# Altium schematic sheet L9963E_BMS_IC.SchDoc
size A2; SheetNumber: 2; SheetTotal: 4
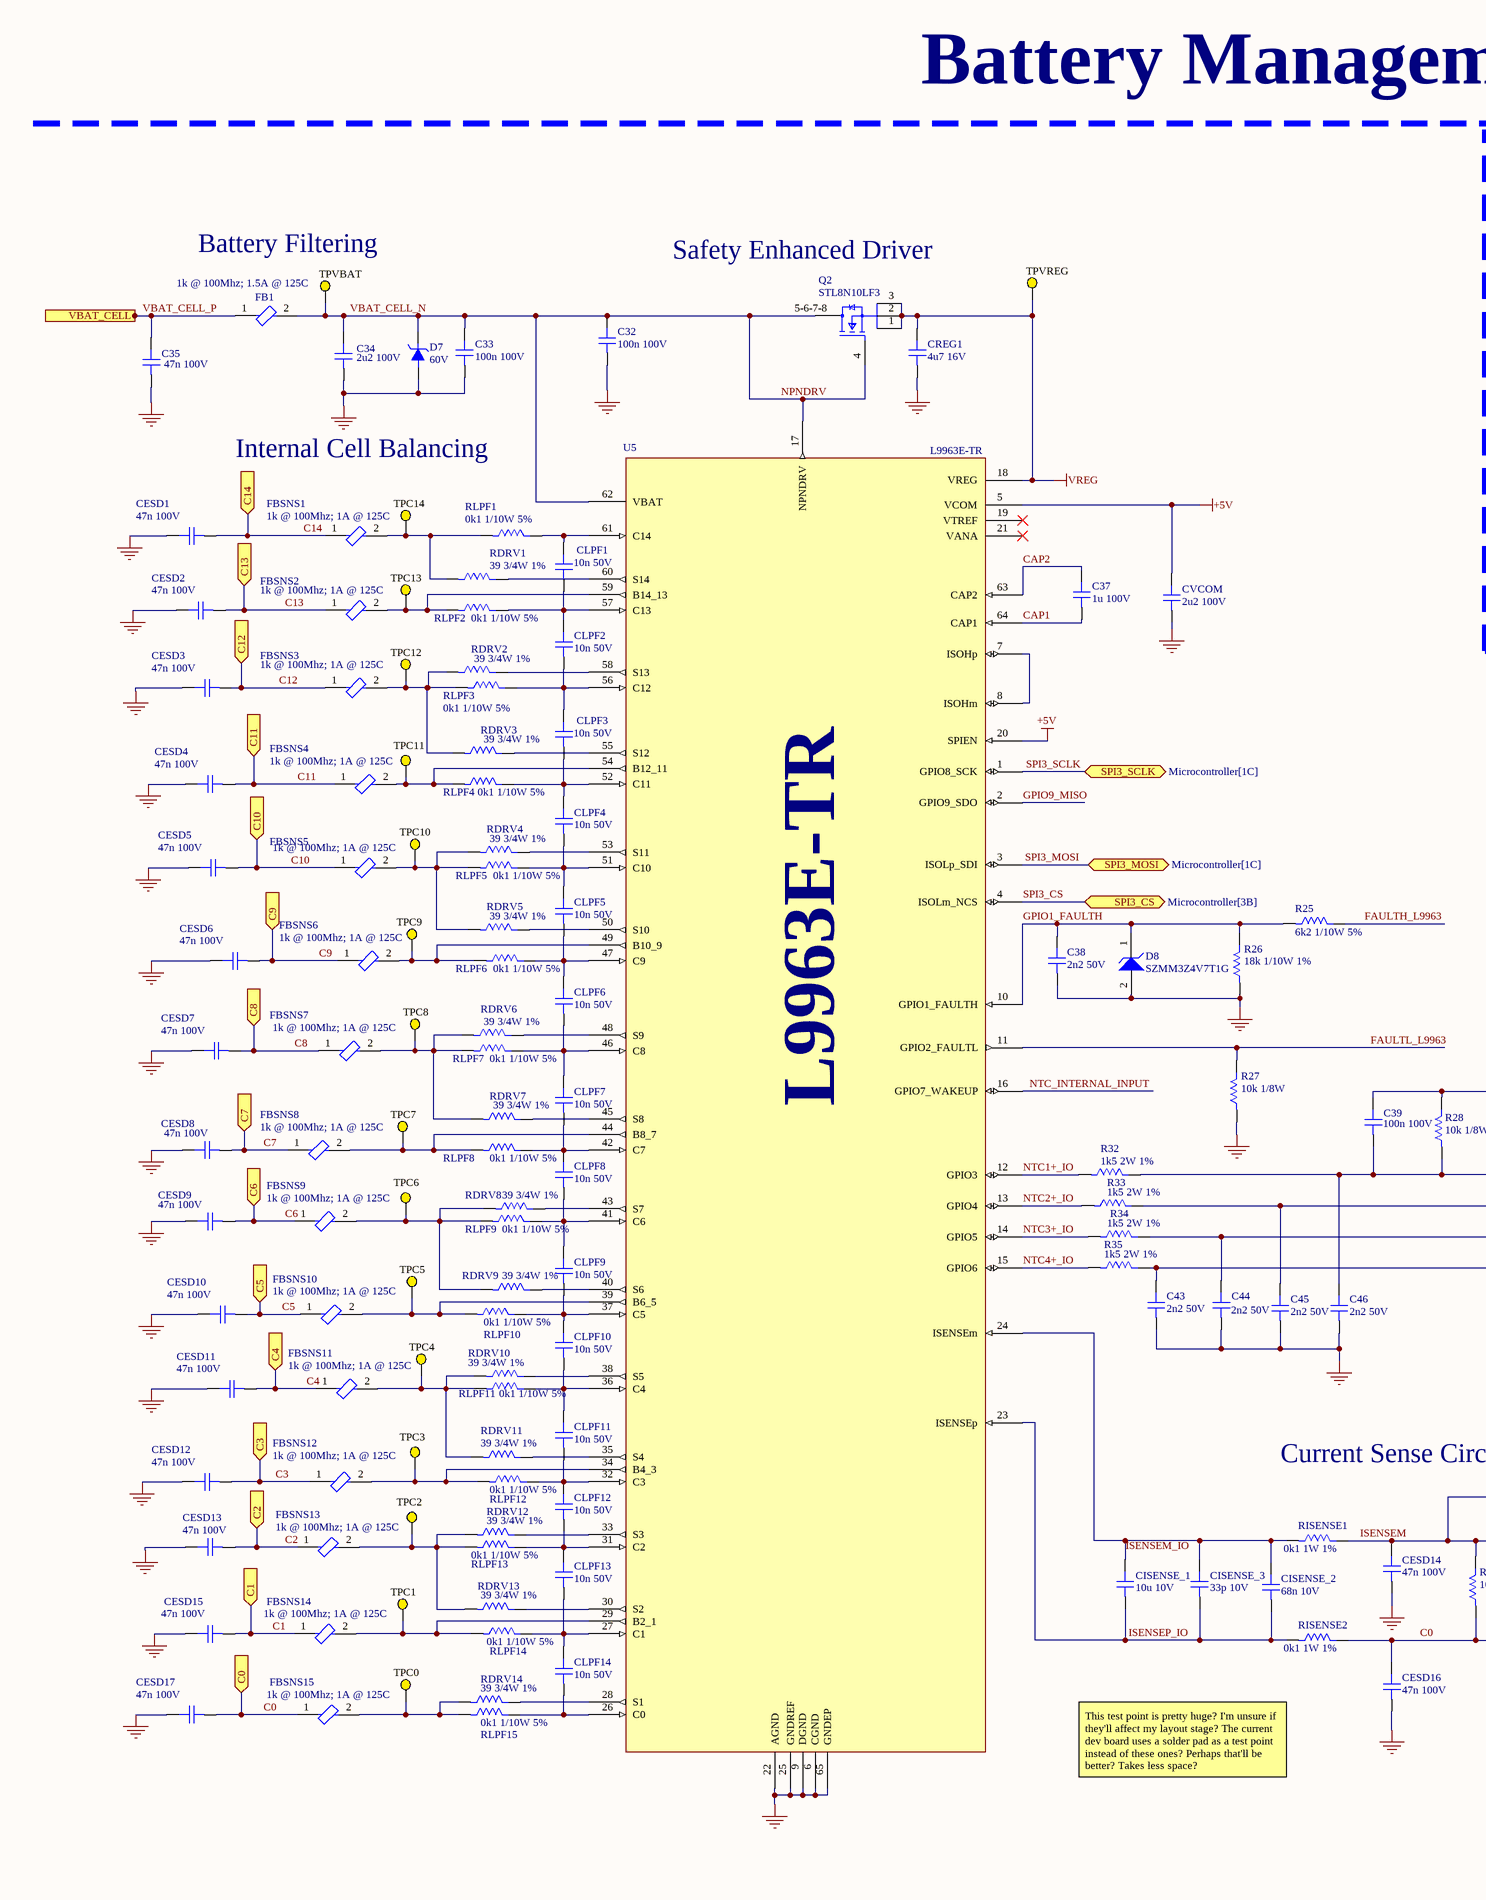
[diagram p0: L9963E_BMS_IC.SchDoc, left]
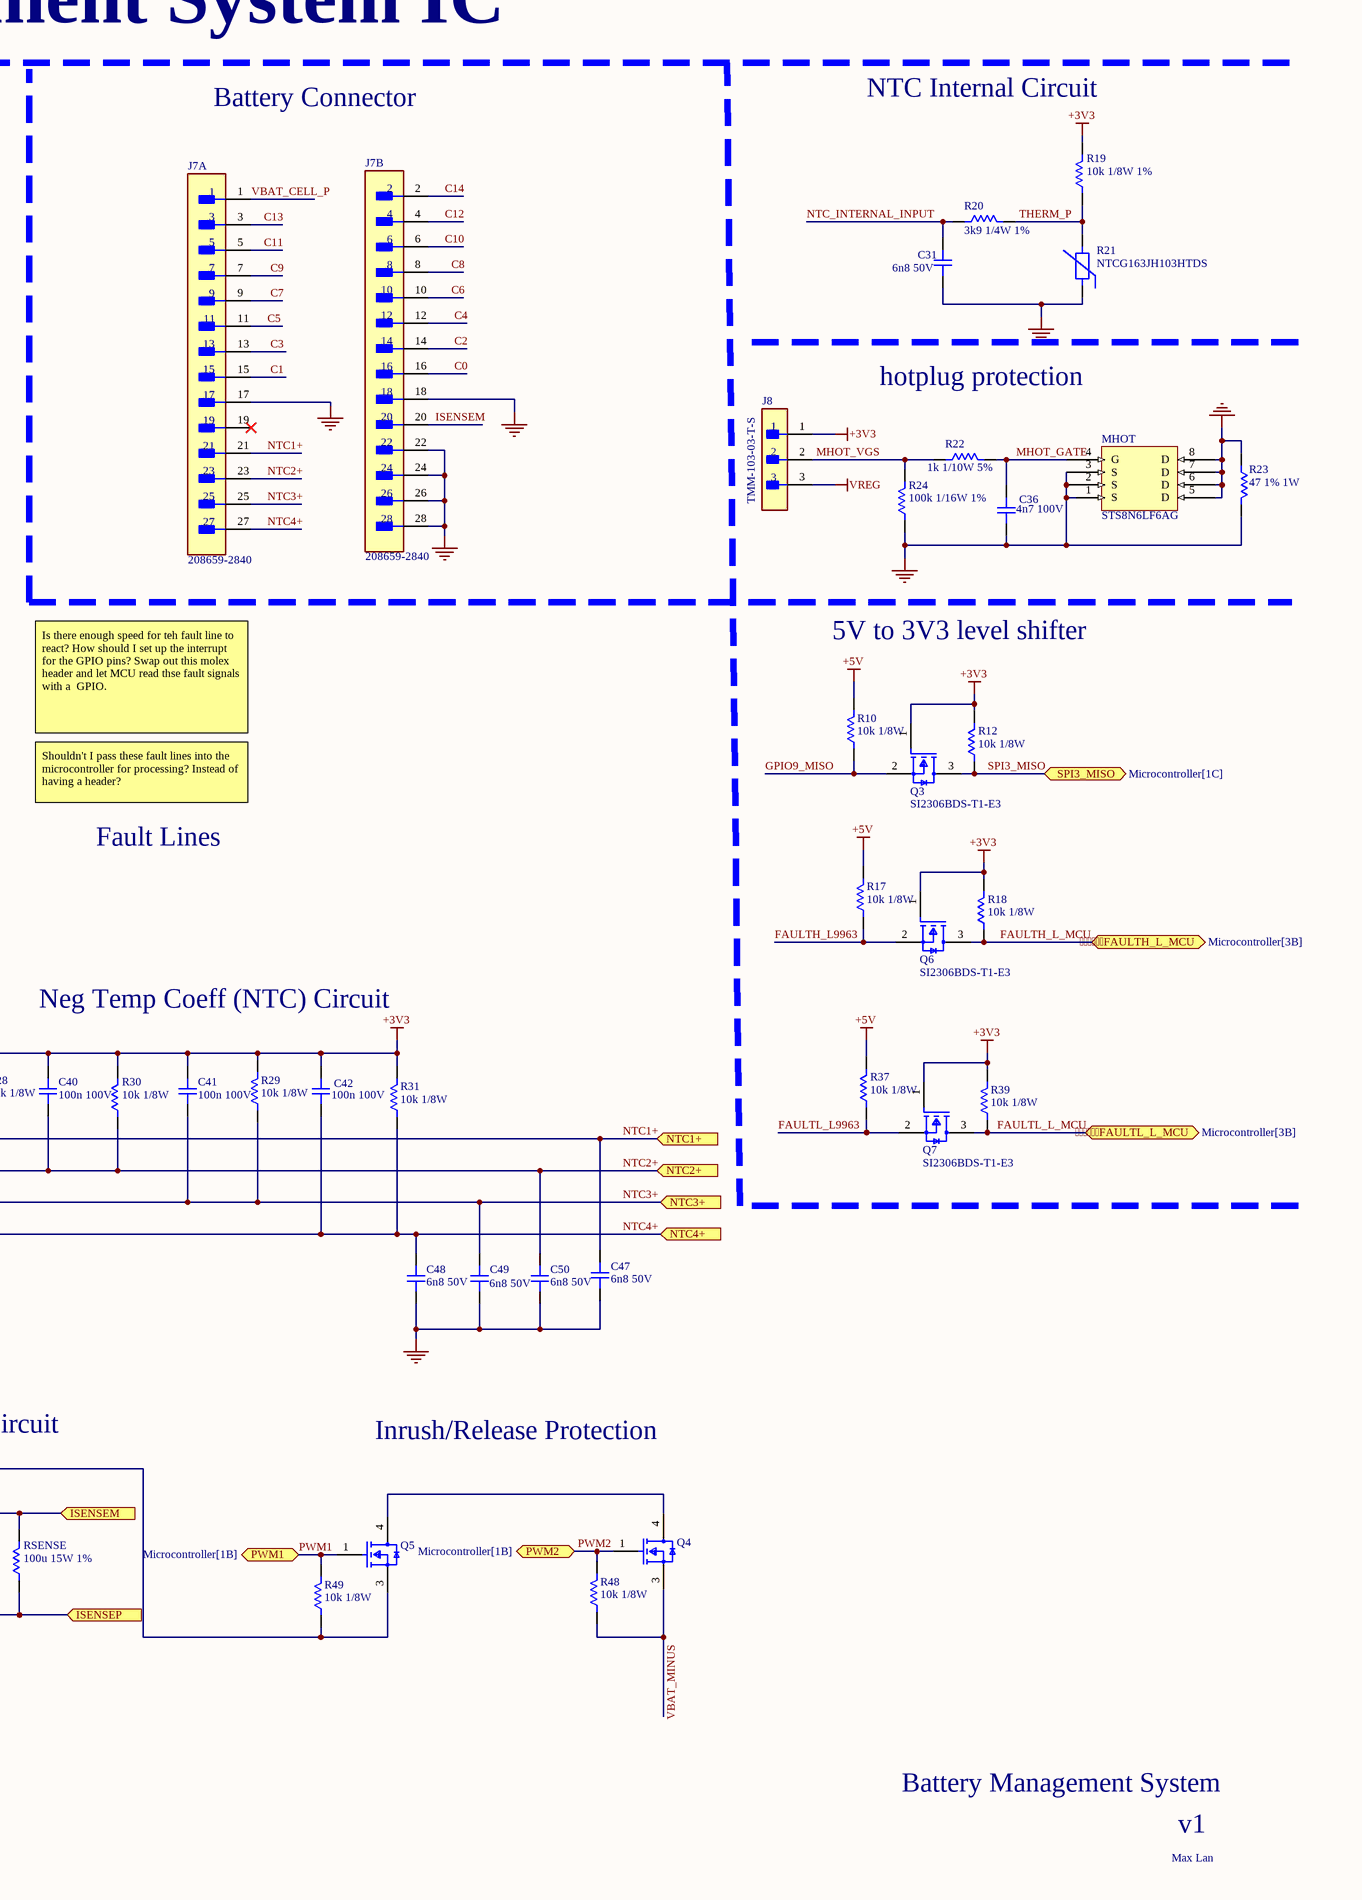
[diagram p1: L9963E_BMS_IC.SchDoc, right]

## Parts
C31  6n8 50V  [CAP_0603]
C32  100n 100V  [CAP_0603]
C33  100n 100V  [CAP_0603]
C34  2u2 100V  [CAP_1210]
C35  47n 100V  [CAP_0603]
C36  4n7 100V  [CAP_0603]
C37  1u 100V  [CAP_0603]
C38  2n2 50V  [CAP_0603]
C39  100n 100V  [CAP_0603]
C40  100n 100V  [CAP_0603]
C41  100n 100V  [CAP_0603]
C42  100n 100V  [CAP_0603]
C43  2n2 50V  [CAP_0603]
C44  2n2 50V  [CAP_0603]
C45  2n2 50V  [CAP_0603]
C46  2n2 50V  [CAP_0603]
C47  6n8 50V  [CAP_0603]
C48  6n8 50V  [CAP_0603]
C49  6n8 50V  [CAP_0603]
C50  6n8 50V  [CAP_0603]
CESD1  47n 100V  [CAP_0603]
CESD2  47n 100V  [CAP_0603]
CESD3  47n 100V  [CAP_0603]
CESD4  47n 100V  [CAP_0603]
CESD5  47n 100V  [CAP_0603]
CESD6  47n 100V  [CAP_0603]
CESD7  47n 100V  [CAP_0603]
CESD8  47n 100V  [CAP_0603]
CESD9  47n 100V  [CAP_0603]
CESD10  47n 100V  [CAP_0603]
CESD11  47n 100V  [CAP_0603]
CESD12  47n 100V  [CAP_0603]
CESD13  47n 100V  [CAP_0603]
CESD14  47n 100V  [CAP_0603]
CESD15  47n 100V  [CAP_0603]
CESD16  47n 100V  [CAP_0603]
CESD17  47n 100V  [CAP_0603]
CISENSE_1  10u 10V  [CAP_0603]
CISENSE_2  68n 10V  [CAP_0603]
CISENSE_3  33p 10V  [CAP_0402]
CLPF1  10n 50V  [CAP_0603]
CLPF2  10n 50V  [CAP_0603]
CLPF3  10n 50V  [CAP_0603]
CLPF4  10n 50V  [CAP_0603]
CLPF5  10n 50V  [CAP_0603]
CLPF6  10n 50V  [CAP_0603]
CLPF7  10n 50V  [CAP_0603]
CLPF8  10n 50V  [CAP_0603]
CLPF9  10n 50V  [CAP_0603]
CLPF10  10n 50V  [CAP_0603]
CLPF11  10n 50V  [CAP_0603]
CLPF12  10n 50V  [CAP_0603]
CLPF13  10n 50V  [CAP_0603]
CLPF14  10n 50V  [CAP_0603]
CREG1  4u7 16V  [CAP_0805]
CVCOM  2u2 100V  [CAP_1210]
D7  60V  [5.0SMDJ60A]
D8  SZMM3Z4V7T1G  [ONSC-SOD-323-2-477-02_V]
FB1  1k @ 100Mhz; 1.5A @ 125C  [FP-MPZ2012-MFG]
FBSNS1  1k @ 100Mhz; 1A @ 125C  [FP-MPZ2012-MFG]
FBSNS2  1k @ 100Mhz; 1A @ 125C  [FP-MPZ2012-MFG]
FBSNS3  1k @ 100Mhz; 1A @ 125C  [FP-MPZ2012-MFG]
FBSNS4  1k @ 100Mhz; 1A @ 125C  [FP-MPZ2012-MFG]
FBSNS5  1k @ 100Mhz; 1A @ 125C  [FP-MPZ2012-MFG]
FBSNS6  1k @ 100Mhz; 1A @ 125C  [FP-MPZ2012-MFG]
FBSNS7  1k @ 100Mhz; 1A @ 125C  [FP-MPZ2012-MFG]
FBSNS8  1k @ 100Mhz; 1A @ 125C  [FP-MPZ2012-MFG]
FBSNS9  1k @ 100Mhz; 1A @ 125C  [FP-MPZ2012-MFG]
FBSNS10  1k @ 100Mhz; 1A @ 125C  [FP-MPZ2012-MFG]
FBSNS11  1k @ 100Mhz; 1A @ 125C  [FP-MPZ2012-MFG]
FBSNS12  1k @ 100Mhz; 1A @ 125C  [FP-MPZ2012-MFG]
FBSNS13  1k @ 100Mhz; 1A @ 125C  [FP-MPZ2012-MFG]
FBSNS14  1k @ 100Mhz; 1A @ 125C  [FP-MPZ2012-MFG]
FBSNS15  1k @ 100Mhz; 1A @ 125C  [FP-MPZ2012-MFG]
J7  208659-2840  [FP-208659-2840-MFG]  (parts A,B of 2)
J8  TMM-103-03-T-S  [FP-TMM-103-03-T-S-MFG]
MHOT  STS8N6LF6AG  [STS8N6LF6AG]
Q2  STL8N10LF3  [FP-PowerFLAT5x6-A0Y5_8231-MFG]
Q3  SI2306BDS-T1-E3  [FP-S-03946-IPC_A]
Q4  HUF76629D3ST  [FP-369AS-MFG]  (value not drawn)
Q5  HUF76629D3ST  [FP-369AS-MFG]  (value not drawn)
Q6  SI2306BDS-T1-E3  [FP-S-03946-IPC_A]
Q7  SI2306BDS-T1-E3  [FP-S-03946-IPC_A]
R10  10k 1/8W  [RES_0603]
R12  10k 1/8W  [RES_0603]
R17  10k 1/8W  [RES_0603]
R18  10k 1/8W  [RES_0603]
R19  10k 1/8W 1%  [RES_0603]
R20  3k9 1/4W 1%  [RES_0805]
R21  NTCG163JH103HTDS  [RES_0603]
R22  1k 1/10W 5%  [RES_0603]
R23  47 1% 1W  [RES_2512]
R24  100k 1/16W 1%  [RES_0402]
R25  6k2 1/10W 5%  [RES_0603]
R26  18k 1/10W 1%  [RES_0603]
R27  10k 1/8W  [RES_0603]
R28  10k 1/8W  [RES_0603]
R29  10k 1/8W  [RES_0603]
R30  10k 1/8W  [RES_0603]
R31  10k 1/8W  [RES_0603]
R32  1k5 2W 1%  [RES_2010]
R33  1k5 2W 1%  [RES_2010]
R34  1k5 2W 1%  [RES_2010]
R35  1k5 2W 1%  [RES_2010]
R37  10k 1/8W  [RES_0603]
R39  10k 1/8W  [RES_0603]
R48  10k 1/8W  [RES_0603]
R49  10k 1/8W  [RES_0603]
RDRV1  39 3/4W 1%  [RES_0603]
RDRV2  39 3/4W 1%  [RES_0603]
RDRV3  39 3/4W 1%  [RES_0603]
RDRV4  39 3/4W 1%  [RES_0603]
RDRV5  39 3/4W 1%  [RES_0603]
RDRV6  39 3/4W 1%  [RES_0603]
RDRV7  39 3/4W 1%  [RES_0603]
RDRV8  39 3/4W 1%  [RES_0603]
RDRV9  39 3/4W 1%  [RES_0603]
RDRV10  39 3/4W 1%  [RES_0603]
RDRV11  39 3/4W 1%  [RES_0603]
RDRV12  39 3/4W 1%  [RES_0603]
RDRV13  39 3/4W 1%  [RES_0603]
RDRV14  39 3/4W 1%  [RES_0603]
RISENSE1  0k1 1W 1%  [RES_2010]
RISENSE2  0k1 1W 1%  [RES_2010]
RLPF1  0k1 1/10W 5%  [RES_0603]
RLPF2  0k1 1/10W 5%  [RES_0603]
RLPF3  0k1 1/10W 5%  [RES_0603]
RLPF4  0k1 1/10W 5%  [RES_0603]
RLPF5  0k1 1/10W 5%  [RES_0603]
RLPF6  0k1 1/10W 5%  [RES_0603]
RLPF7  0k1 1/10W 5%  [RES_0603]
RLPF8  0k1 1/10W 5%  [RES_0603]
RLPF9  0k1 1/10W 5%  [RES_0603]
RLPF10  0k1 1/10W 5%  [RES_0603]
RLPF11  0k1 1/10W 5%  [RES_0603]
RLPF12  0k1 1/10W 5%  [RES_0603]
RLPF13  0k1 1/10W 5%  [RES_0603]
RLPF14  0k1 1/10W 5%  [RES_0603]
RLPF15  0k1 1/10W 5%  [RES_0603]
RSENSE  100u 15W 1%  [RES_5931]
TPC0  5014  [KSTN-5014_V]  (value not drawn)
TPC1  5014  [KSTN-5014_V]  (value not drawn)
TPC2  5014  [KSTN-5014_V]  (value not drawn)
TPC3  5014  [KSTN-5014_V]  (value not drawn)
TPC4  5014  [KSTN-5014_V]  (value not drawn)
TPC5  5014  [KSTN-5014_V]  (value not drawn)
TPC6  5014  [KSTN-5014_V]  (value not drawn)
TPC7  5014  [KSTN-5014_V]  (value not drawn)
TPC8  5014  [KSTN-5014_V]  (value not drawn)
TPC9  5014  [KSTN-5014_V]  (value not drawn)
TPC10  5014  [KSTN-5014_V]  (value not drawn)
TPC11  5014  [KSTN-5014_V]  (value not drawn)
TPC12  5014  [KSTN-5014_V]  (value not drawn)
TPC13  5014  [KSTN-5014_V]  (value not drawn)
TPC14  5014  [KSTN-5014_V]  (value not drawn)
TPVBAT  5014  [KSTN-5014_V]  (value not drawn)
TPVREG  5014  [KSTN-5014_V]  (value not drawn)
U5  L9963E-TR  [L9963E-TR]

## Ports
FAULTH_L_MCU (bidir, see Microcontroller[3B]), FAULTL_L_MCU (bidir, see Microcontroller[3B]), C0 (in), C1 (in), C2 (in), C3 (in), C4 (in), C5 (in), C6 (in), C7 (in), C8 (in), C9 (in), C10 (in), C11 (in), C12 (in), C13 (in), C14 (in), ISENSEM (in), ISENSEP (in), NTC1+ (in), NTC2+ (in), NTC3+ (in), NTC4+ (in), PWM1 (bidir, see Microcontroller[1B]), PWM2 (bidir, see Microcontroller[1B]), SPI3_CS (bidir, see Microcontroller[3B]), SPI3_MISO (bidir, see Microcontroller[1C]), SPI3_MOSI (bidir, see Microcontroller[1C]), SPI3_SCLK (bidir, see Microcontroller[1C]), VBAT_CELL (in)

## Nets
+3V3: C39.2 C40.2 C41.2 C42.2 J8.1 Q3.1(G) Q6.1(G) Q7.1(G) R12.2 R18.2 R19.2 R28.2 R29.2 R30.2 R31.2 R39.2
+5V: CVCOM.2 R10.2 R17.2 R37.2 U5.5(VCOM) U5.20(SPIEN)
GND: C31.1 C32.1 C33.1 C34.1 C35.1 C36.1 C38.1 C43.1 C44.1 C45.1 C46.1 C47.1 C48.1 C49.1 C50.1 CESD1.2 CESD2.2 CESD3.2 CESD4.2 CESD5.2 CESD6.2 CESD7.2 CESD8.2 CESD9.2 CESD10.2 CESD11.2 CESD12.2 CESD13.2 CESD14.1 CESD15.2 CESD16.1 CESD17.2 CREG1.1 CVCOM.1 D7.A D8.2(A) J7.17 J7.18 J7.22 J7.24 J7.26 J7.28 MHOT.1(S) MHOT.2(S) MHOT.3(S) MHOT.5(D) MHOT.6(D) MHOT.7(D) MHOT.8(D) R21.2 R23.1 R23.2 R24.1 R26.1 R27.1 U5.6(CGND) U5.9(DGND) U5.22(AGND) U5.25(GNDREF) U5.65(GNDEP)
VREG: CREG1.2 J8.3 Q2.1(S) Q2.2(S) Q2.3(S) TPVREG.1 U5.18(VREG)
C0: CESD16.2 CESD17.1 FBSNS15.1 J7.16 RISENSE2.2 RSENSE.1 ; port C0, port ISENSEP
C1: CESD15.1 FBSNS14.1 J7.15 ; port C1
C2: CESD13.1 FBSNS13.1 J7.14 ; port C2
C3: CESD12.1 FBSNS12.1 J7.13 ; port C3
C4: CESD11.1 FBSNS11.1 J7.12 ; port C4
C5: CESD10.1 FBSNS10.1 J7.11 ; port C5
C6: CESD9.1 FBSNS9.1 J7.10 ; port C6
C7: CESD8.1 FBSNS8.1 J7.9 ; port C7
C8: CESD7.1 FBSNS7.1 J7.8 ; port C8
C9: CESD6.1 FBSNS6.1 J7.7 ; port C9
C10: CESD5.1 FBSNS5.1 J7.6 ; port C10
C11: CESD4.1 FBSNS4.1 J7.5 ; port C11
C12: CESD3.1 FBSNS3.1 J7.4 ; port C12
C13: CESD2.1 FBSNS2.1 J7.3 ; port C13
C14: CESD1.1 FBSNS1.1 J7.2 ; port C14
CAP1: C37.1 U5.64(CAP1)
CAP2: C37.2 U5.63(CAP2)
FAULTH_L9963: Q6.2(S) R17.1 R25.2
FAULTH_L_MCU: Q6.3(D) R18.1 ; port FAULTH_L_MCU
FAULTL_L9963: Q7.2(S) R27.2 R37.1 U5.11(GPIO2_FAULTL)
FAULTL_L_MCU: Q7.3(D) R39.1 ; port FAULTL_L_MCU
GPIO1_FAULTH: C38.2 D8.1(K) R25.1 R26.2 U5.10(GPIO1_FAULTH)
GPIO9_MISO: Q3.2(S) R10.1 U5.2(GPIO9_SDO)
ISENSEM: CESD14.2 J7.20 Q5.3(S) R49.1 RISENSE1.2 RSENSE.2 ; port ISENSEM
ISENSEM_IO: CISENSE_1.2 CISENSE_2.2 CISENSE_3.2 RISENSE1.1 U5.24(ISENSEm)
ISENSEP_IO: CISENSE_1.1 CISENSE_2.1 CISENSE_3.1 RISENSE2.1 U5.23(ISENSEp)
MHOT_GATE: C36.2 MHOT.4(G) R22.2
MHOT_VGS: J8.2 R22.1 R24.2
NPNDRV: C32.2 C33.2 C34.2 D7.K FB1.2 Q2.4(G) Q2.5-6-7-8(D) TPVBAT.1 U5.17(NPNDRV) U5.62(VBAT)  [also labelled VBAT_CELL_N]
NTC1+: C39.1 C46.2 C47.2 J7.21 R28.1 R32.2 ; port NTC1+
NTC1+_IO: R32.1 U5.12(GPIO3)
NTC2+: C40.1 C45.2 C50.2 J7.23 R30.1 R33.2 ; port NTC2+
NTC2+_IO: R33.1 U5.13(GPIO4)
NTC3+: C41.1 C44.2 C49.2 J7.25 R29.1 R34.2 ; port NTC3+
NTC3+_IO: R34.1 U5.14(GPIO5)
NTC4+: C42.1 C43.2 C48.2 J7.27 R31.1 R35.2 ; port NTC4+
NTC4+_IO: R35.1 U5.15(GPIO6)
NTC_INTERNAL_INPUT: C31.2 R20.1 U5.16(GPIO7_WAKEUP)
PWM1: Q5.1(G) R49.2 ; port PWM1
PWM2: Q4.1(G) R48.2 ; port PWM2
SPI3_CS: U5.4(ISOLm_NCS) ; port SPI3_CS
SPI3_MISO: Q3.3(D) R12.1 ; port SPI3_MISO
SPI3_MOSI: U5.3(ISOLp_SDI) ; port SPI3_MOSI
SPI3_SCLK: U5.1(GPIO8_SCK) ; port SPI3_SCLK
THERM_P: R19.1 R20.2 R21.1
VBAT_CELL_P: C35.2 FB1.1 J7.1 ; port VBAT_CELL
VBAT_MINUS: Q4.3(S) R48.1
NetCLPF1_1: CLPF1.1 CLPF2.2 RLPF2.2 U5.57(C13)
NetCLPF1_2: CLPF1.2 RLPF1.2 U5.61(C14)
NetCLPF2_1: CLPF2.1 CLPF3.2 RLPF3.2 U5.56(C12)
NetCLPF3_1: CLPF3.1 CLPF4.2 RLPF4.2 U5.52(C11)
NetCLPF4_1: CLPF4.1 CLPF5.2 RLPF5.2 U5.51(C10)
NetCLPF5_1: CLPF5.1 CLPF6.2 RLPF6.2 U5.47(C9)
NetCLPF6_1: CLPF6.1 CLPF7.2 RLPF7.2 U5.46(C8)
NetCLPF7_1: CLPF7.1 CLPF8.2 RLPF8.2 U5.42(C7)
NetCLPF8_1: CLPF8.1 CLPF9.2 RLPF9.2 U5.41(C6)
NetCLPF9_1: CLPF9.1 CLPF10.2 RLPF10.2 U5.37(C5)
NetCLPF10_1: CLPF10.1 CLPF11.2 RLPF11.2 U5.36(C4)
NetCLPF11_1: CLPF11.1 CLPF12.2 RLPF12.2 U5.32(C3)
NetCLPF12_1: CLPF12.1 CLPF13.2 RLPF13.2 U5.31(C2)
NetCLPF13_1: CLPF13.1 CLPF14.2 RLPF14.2 U5.27(C1)
NetCLPF14_1: CLPF14.1 RLPF15.2 U5.26(C0)
NetFBSNS1_2: FBSNS1.2 RDRV1.1 RLPF1.1 TPC14.1
NetFBSNS2_2: FBSNS2.2 RLPF2.1 TPC13.1 U5.59(B14_13)
NetFBSNS3_2: FBSNS3.2 RDRV2.1 RDRV3.1 RLPF3.1 TPC12.1
NetFBSNS4_2: FBSNS4.2 RLPF4.1 TPC11.1 U5.54(B12_11)
NetFBSNS5_2: FBSNS5.2 RDRV4.1 RDRV5.1 RLPF5.1 TPC10.1
NetFBSNS6_2: FBSNS6.2 RLPF6.1 TPC9.1 U5.49(B10_9)
NetFBSNS7_2: FBSNS7.2 RDRV6.1 RDRV7.1 RLPF7.1 TPC8.1
NetFBSNS8_2: FBSNS8.2 RLPF8.1 TPC7.1 U5.44(B8_7)
NetFBSNS9_2: FBSNS9.2 RDRV8.1 RDRV9.1 RLPF9.1 TPC6.1
NetFBSNS10_2: FBSNS10.2 RLPF10.1 TPC5.1 U5.39(B6_5)
NetFBSNS11_2: FBSNS11.2 RDRV10.1 RDRV11.1 RLPF11.1 TPC4.1
NetFBSNS12_2: FBSNS12.2 RLPF12.1 TPC3.1 U5.34(B4_3)
NetFBSNS13_2: FBSNS13.2 RDRV12.1 RDRV13.1 RLPF13.1 TPC2.1
NetFBSNS14_2: FBSNS14.2 RLPF14.1 TPC1.1 U5.29(B2_1)
NetFBSNS15_2: FBSNS15.2 RDRV14.1 RLPF15.1 TPC0.1
NetQ4_4: Q4.4(D) Q5.4(D)
NetRDRV1_2: RDRV1.2 U5.60(S14)
NetRDRV2_2: RDRV2.2 U5.58(S13)
NetRDRV3_2: RDRV3.2 U5.55(S12)
NetRDRV4_2: RDRV4.2 U5.53(S11)
NetRDRV5_2: RDRV5.2 U5.50(S10)
NetRDRV6_2: RDRV6.2 U5.48(S9)
NetRDRV7_2: RDRV7.2 U5.45(S8)
NetRDRV8_2: RDRV8.2 U5.43(S7)
NetRDRV9_2: RDRV9.2 U5.40(S6)
NetRDRV10_2: RDRV10.2 U5.38(S5)
NetRDRV11_2: RDRV11.2 U5.35(S4)
NetRDRV12_2: RDRV12.2 U5.33(S3)
NetRDRV13_2: RDRV13.2 U5.30(S2)
NetRDRV14_2: RDRV14.2 U5.28(S1)
NetU5_7: U5.7(ISOHp) U5.8(ISOHm)

Not connected (* = marked no-connect by the designer): J7 19*; U5 19(VTREF)* 21(VANA)*

## Notes on the sheet
- Battery Management System IC
- Battery Connector
- NTC Internal Circuit
- (near TPVBAT) Battery Filtering
- (near Q2) Safety Enhanced Driver
- Internal Cell Balancing
- hotplug protection
- 5V to 3V3 level shifter
- Is there enough speed for teh fault line to react? How should I set up the interrupt for the GPIO pins? Swap out this molex header and let MCU read thse fault signals with a  GPIO.
- Shouldn't I pass these fault lines into the microcontroller for processing? Instead of having a header?
- Fault Lines
- Neg Temp Coeff (NTC) Circuit
- Current Sense Circuit
- Inrush/Release Protection
- This test point is pretty huge? I'm unsure if they'll affect my layout stage? The current dev board uses a solder pad as a test point instead of these ones? Perhaps that'll be better? Takes less space?
- Battery Management System
- Max Lan
- v1

## Library data of the parts
C31 C47-C50 = 06035C682MAT2A: Multilayer Ceramic Capacitors MLCC - SMD/SMT KGM15AR71H682MT NEW GLOBAL PN 50V 6800pF A 581-KGM15AR71H682MT; Manufacturer: KYOCERA AVX; Rating: 6.8nF 50V X7R 0603; Manufacturer Part Number: 06035C682MAT2A; Distributor Link: https://www.mouser.tw/en/ProductDetail/KYOCERA-AVX/06035C682MAT2A?qs=Jt0XQ7CXnDG9m2YKP51QXw%3D%3D; Datasheet Link: https://datasheets.kyocera-avx.com/KGM_X7R.pdf; Dielectric: *
C32 C33 C39-C42 = MAJCH168BB7104KTEA01: Multilayer Ceramic Capacitors MLCC - SMD/SMT 100V 0.1uF 0603 X7R 10% AECQ2; Manufacturer: TAIYO YUDEN; Rating: 100nF 100V X7R 0603 10%; Manufacturer Part Number: MAJCH168BB7104KTEA01; Distributor Link: https://www.mouser.tw/en/ProductDetail/TAIYO-YUDEN/MAJCH168BB7104KTEA01?qs=ZcfC38r4PovaTBrG0IdezQ%3D%3D; Datasheet Link: https://www.mouser.com/catalog/specsheets/TAIYO_YUDEN_03-08-2024_MAJCH168BB7104KTEA01_SS.pdf?_gl=1*17qbpp1*_gcl_aw*R0NMLjE3ODUyMjg2NDkuQ2p3S0NBandwcUhUQmhBY0Vpd0FqMkFmdXJYOV9OUy1CV0xFSmd6T0FaYy1HZXR1bHVfaUZmaHVzRkI2bHhkODVUMjVSNlJWbnBOUkFob0NEdHNRQXZEX0J3RQ..*_gcl_au*MTM0NzYwMzc0Mi4xNzgyNDQ3MDMwLjE4MDQ0Nzg2ODUuMTc4NTI5MDg4OS4xNzg1MjkxOTE2LjE1NDk0Mzk5MTcuMTc4NTIxODYwOC4xNzg1MjkxOTE2*_ga*MTg5NTU5OTIyLjE3ODI0NDcwMzM.*_ga_15W4STQT4T*czE3ODUyODM3NTgkbzk5JGcxJHQxNzg1MjkxOTI1JGo0MiRsMCRoMA..; Dielectric: *
C34 CVCOM = C1210C225J1RACAUTO: Multilayer Ceramic Capacitors MLCC - SMD/SMT 100V 2.2uF X7R 1210 5% AEC-Q200; Manufacturer: KEMET; Rating: 2.2uF 100V X7R 1210 5%; Manufacturer Part Number: C1210C225J1RACAUTO; Distributor Link: https://www.mouser.tw/en/ProductDetail/KEMET/C1210C225J1RACAUTO?qs=sGAEpiMZZMvsSlwiRhF8qtbmv%2FbKa1yYzrRuCBjX9aFrg%252BEkfh5A0g%3D%3D; Datasheet Link: https://www.mouser.tw/datasheet/3/508/1/KEM_C1023_X7R_AUTO_SMD.pdf; Dielectric: *
C35 CESD1-CESD17 = C0603C473J1RACTU: Multilayer Ceramic Capacitors MLCC - SMD/SMT 100V 0.047uF X7R 0603 5%; Manufacturer: KEMET; Rating: 47nF 100V X7R 0603 5%; Manufacturer Part Number: C0603C473J1RACTU; Distributor Link: https://www.mouser.tw/en/ProductDetail/KEMET/C0603C473J1RACTU?qs=sGAEpiMZZMvsSlwiRhF8qpRMYGxmftL79YZ310PzB5U%3D; Datasheet Link: https://www.mouser.tw/datasheet/3/72/1/C0603C473J1RACTU.pdf; Dielectric: *
C36 = CGA3E2X7R2A472K080AA: Multilayer Ceramic Capacitors MLCC - SMD/SMT CGA 0603 100V 4700pF X7R 10% AEC-Q200; Manufacturer: TDK; Rating: 4.7nF 100V 10% X7R 0603; Manufacturer Part Number: CGA3E2X7R2A472K080AA; Distributor Link: https://www.mouser.tw/en/ProductDetail/TDK/CGA3E2X7R2A472K080AA?qs=NRhsANhppD8QTPocwjf0SQ%3D%3D; Datasheet Link: https://product.tdk.com/system/files/dam/doc/product/capacitor/ceramic/mlcc/catalog/mlcc_automotive_midvoltage_en.pdf?ref_disty=mouser; Dielectric: *
C37 = C1608X7R2A105K080AC: MLCC - SMD/SMT Commercial Grade,MLCC,0603,X7R,100V,1uF,+/-10%,0.8mm; Manufacturer Name: TDK; ComponentLink1Description: Datasheet Link 1; ComponentLink1URL: https://product.tdk.com/system/files/dam/doc/product/capacitor/ceramic/mlcc/catalog/mlcc_commercial_general_en.pdf; Distributor Name: Mouser; ComponentLink2Description: Distributor Link 1; ComponentLink2URL: https://www.mouser.tw/zh/ProductDetail/TDK/C1608X7R2A105K080AC?qs=efUn273yAhc5BfjaNflQJg%3D%3D; Value: 0603,X7R,100V,1uF,
C38 C43-C46 = KAM15AR71H222KT: Multilayer Ceramic Capacitors MLCC - SMD/SMT 50V 2200pF X7R 0603 10% AEC-Q200; Manufacturer: KYOCERA AVX; Rating: 2.2nF 50V X7R 0603 10%; Manufacturer Part Number: KAM15AR71H222KT; Distributor Link: https://www.mouser.tw/en/ProductDetail/KYOCERA-AVX/KAM15AR71H222KT?qs=OcgtsXO%252B3gvpJlkWsZMdBg%3D%3D; Datasheet LInk: https://ele.kyocera.com/assets/products/capacitor/KGM_Series_e.pdf; Dielectric: *
CISENSE_1 = GRM188Z71A106KA73D: Multilayer Ceramic Capacitors MLCC - SMD/SMT 10 uF 10 VDC 10% 0603 X7R; Manufacturer: Murata Electronics; Rating: 10uF 10V X7R 0603 10%; Manufacturer Part Number: GRM188Z71A106KA73D; Distributor Link: https://www.mouser.tw/en/ProductDetail/Murata-Electronics/GRM188Z71A106KA73D?qs=sGAEpiMZZMvsSlwiRhF8qtsGU%2FCnaNeQz1Jv5GwJ1ahYh1H97x5nNw%3D%3D; Datasheet Link: https://www.mouser.tw/datasheet/3/76/2/GRM188Z71A106KA73_01A.pdf; Dielectric: *
CISENSE_2 = VJ0603Y683JXQCW1BC: Multilayer Ceramic Capacitors MLCC - SMD/SMT 0603 0.068uF 10volts X7R 5%; Manufacturer: Vishay/Vitramon; Rating: 68nF 10V X7R 0603 5%; Manufacturer Part Number: VJ0603Y683JXQCW1BC; Distributor Link: https://www.mouser.tw/en/ProductDetail/Vishay-Vitramon/VJ0603Y683JXQCW1BC?qs=sGAEpiMZZMvsSlwiRhF8qsy6D4RIz3svadoEWL3SLRA%3D; Datasheet Link: https://www.vishay.com/doc?28548; Dielectric: *
CISENSE_3 = KGM05AR71A330KH: Multilayer Ceramic Capacitors MLCC - SMD/SMT 10V 33pF X7R 0402 10%; Manufacturer: KYOCERA AVX; Rating: 33pF 10V X7R 0402 10%; Manufacturer Part Number: KGM05AR71A330KH; Distributor Link: https://www.mouser.tw/en/ProductDetail/KYOCERA-AVX/KGM05AR71A330KH?qs=sGAEpiMZZMvsSlwiRhF8qrQG6leidpLjKweERFFvD5%2FTA98x%2FHGWTg%3D%3D; Datasheet Link: https://ele.kyocera.com/assets/products/capacitor/KGM_Series_e.pdf; Dielectric: *
CLPF1-CLPF14 = KAF15AR71H103JM: Multilayer Ceramic Capacitors MLCC - SMD/SMT Automotive MLCC 0603, 10nF, 5%, X7R, 50VDC; Manufacturer: KYOCERA AVX; Rating: 10nF 50V X7R 0603 5%; Manufacturer Part Number: KAF15AR71H103JM; Distributor Link: https://www.mouser.tw/en/ProductDetail/KYOCERA-AVX/KAF15AR71H103JM?qs=sGAEpiMZZMvsSlwiRhF8qrQG6leidpLjNf3RmkJWfl3qRaUgdYaoYg%3D%3D; Datasheet Link: https://www.mouser.tw/datasheet/3/5926/1/AutoMLCCKAF.pdf; Dielectric: *
CREG1 = C0805C475J4RACAUTO7210: Multilayer Ceramic Capacitors MLCC - SMD/SMT 16 V 4.7 uF 0805 X7R 5 % AECQ200; Manufacturer: KEMET; Rating: 4.7uF 16V X7R 0805 5%; Manufacturer Part Number: C0805C475J4RACAUTO7210; Distributor Link: https://www.mouser.tw/en/ProductDetail/KEMET/C0805C475J4RACAUTO7210?qs=sGAEpiMZZMsh%252B1woXyUXj8cbwg7mY%252Bp%2F256b4GbLr%252BU%3D; Datasheet Link: https://www.mouser.tw/datasheet/3/508/1/KEM_C1023_X7R_AUTO_SMD.pdf; Dielectric: *
D7 = 5.0SMDJ60A: ESD 保護二極體 / TVS 二極體 60V 5KW 5% UNI DO-214AB (SMC); Manufacturer Name: Bourns; ComponentLink1Description: Datasheet Link; ComponentLink1URL: https://www.mouser.tw/datasheet/3/40/1/5_0smdj.pdf
D8 = CMP-1060-00696-1: Zener Voltage Regulator, 300 mW, 2-Pin SOD-323, Pb-Free, Tape and Reel; Manufacturer: On Semiconductor; VZ Typ (V): 4.7; P Max (W): 0.3; ComponentLink3URL: http://www.onsemi.com/pub_link/Collateral/477-02.PDF.1; ComponentLink3Description: Package Specification; ComponentLink2Description: Datasheet; DatasheetVersion: Rev. 9; RoHS: Pb-Free; PartNumber: SZMM3Z4V7T1G; ComponentLink2URL: http://www.onsemi.cn/pub_link/Collateral/MM3Z2V4T1-D.PDF; Packing: Tape and Reel; ComponentLink1URL: http://www.onsemi.com/; ComponentLink1Description: Manufacturer URL; Mounting Technology: Surface Mount; PackageVersion: Rev. H, 03/2007; PackageDescription: 2-Pin SOD, Body 1.7 x 1.25 mm; PackageReference: SOD-323-2-477-02
FB1 = CMP-08257-000025-1: FERRITE BEAD 1 KOHM 0805 1LN; Tolerance: 25%; Number of Lines: 1; DC Resistance (DCR): 150mR; Impedance: 1kR; Case Code (Metric): 2012; Mount: Surface Mount; Case/Package: 0805; Case Code (Imperial): 0805; Max Current Rating: 1.5A; Height: 0.041inch; Max DC Current: 1.5A; Min Operating Temperature: -55°C; Length: 0.079inch; Width: 1.25mm; Ratings: AEC-Q200; Packaging: Tape and Reel; RoHS Compliant: Yes; Termination: SMD/SMT; Test Frequency: 100MHz; Package Quantity: 4000; Weight: 0.000194oz; Max Operating Temperature: 125°C; Lead Free: Lead Free
FBSNS1-FBSNS15 = CMP-08257-000025-1: FERRITE BEAD 1 KOHM 0805 1LN; Max Current Rating: 1.5A; Tolerance: 25%; Number of Lines: 1; DC Resistance (DCR): 150mR; Impedance: 1kR; Case Code (Metric): 2012; Mount: Surface Mount; Case/Package: 0805; Case Code (Imperial): 0805; Height: 0.041inch; Max DC Current: 1.5A; Min Operating Temperature: -55°C; Length: 0.079inch; Width: 1.25mm; Ratings: AEC-Q200; Packaging: Tape and Reel; RoHS Compliant: Yes; Termination: SMD/SMT; Test Frequency: 100MHz; Package Quantity: 4000; Weight: 0.000194oz; Max Operating Temperature: 125°C; Lead Free: Lead Free
J7 = CMP-04776-000733-1: IGRID PLUG TH HDR RA GF 28CKT
J8 = CMP-02766-001695-1: CONN HEADER VERT 3POS 2MM; Gender: Male; Number of Positions: 3; Max Current Rating: 3.9A; Max Voltage Rating (AC): 500V; Packaging: Bulk; RoHS Compliant: Yes; Mount: Through Hole; Length: 6mm; Contact Type: Male Pin; Package Quantity: 1; Depth: 1.97mm; Contact Material: Bronze; Insulation Material: Polymer; Series: TMM; Contact Plating: Tin; Fastening Type: Pull; Housing Color: Black; Pitch: 2mm; Termination: Solder; Contact Mating Length: 0.157inch; Min Operating Temperature: -55°C; REACH SVHC: No SVHC; Orientation: Straight; Number of Rows: 1; Color: Black; Insulation Color: Black; Connector Type: Header; Radiation Hardening: No; Number of Contacts: 3; Lead Free: Lead Free; Contact Finish - Mating: TIN; Max Operating Temperature: 105°C; Housing Material: Polymer; Contact Shape: Square
MHOT = STS8N6LF6AG: Automotive-grade N-channel 60 V, 21 mΩ typ., 8 A STripFET F6 / Power MOSFET in an SO-8 package; Manufacturer Name: STMicroelectronics; Ratings: 60 V, 21 mOhm typ., 8 A; ComponentLink1Description: Datasheet Link; ComponentLink1URL: https://www.st.com/resource/en/datasheet/sts8n6lf6ag.pdf; ComponentLink2Description: Distributor Link; ComponentLink2URL: https://www.mouser.tw/en/ProductDetail/STMicroelectronics/STS8N6LF6AG?qs=Mv7BduZupUjwgFHuxl15FA%3D%3D; Distributor Name: Mouser
Q2 = CMP-12198-000012-1: MOSFET N CH 100V 20A PWRFLT5X6; Manufacturer: STMicroelectronics; Number Of N Channels: 1; Max Forward Diode Voltage: 1.3V; Turn On Delay Time: 8.7ns; Power Dissipation: 70W; Input Capacitace At Vds: 970pF @ 25V; Depletion Mode: False; Drain To Source Resistance: 25mΩ; Gate Charge At Vgs: 20.5nC @ 10V; Threshold Vgs Min: 1V; Max Junction Temp: +175°C; Reverse Recovery Time: 42.5ns; Standoff Height: 0.02mm; Reverse Recovery Charge: 87nC; Automotive Grade: Grade 0; Pulse Drain Current: 31.2A; Gate To Source Voltage: 20V; Turn Off Delay Time: 50.6ns; Threshold Vgs Max: 3V; Octopart: https://octopart.com/stl8n10lf3-stmicroelectronics-28565037; Automotive: Yes; Drain To Source Breakdown Voltage: 100V; Temperature Range Low: -55°C; Manufacturer Part Number: STL8N10LF3; Digikey Description: MOSFET N CH 100V 20A PWRFLT5X6; Device Class L1: Discrete Semiconductors; Mouser Description: Trans MOSFET N-CH 100V 20A Automotive 8-Pin Power Flat T/R; Temperature Range High: +175°C; ComponentLink2Description: Datasheet; Device Class L3: MOSFETs; Height: 1mm; Drain To Source Voltage: 100V; Device Class L2: Transistors; RoHS: TRUE; Number Of Channels: 1; Category: Trans; Temperature: -55°C to +175°C; ComponentLink2URL: https://www.st.com/resource/en/datasheet/stl8n10lf3.pdf; Lead Free: Yes; Continuous Drain Current: 20A; Package: PowerFLAT5x6-A0Y5_8231817_R_WF
Q3 Q6 Q7 = CMP-02550-000327-1: MOSFET N-CH 30V 3.16A SOT23-3
Q4 Q5 = CMP-00278-84329156-1: HUF76629D3ST N-Channel Logic Level UltraFET® Power MOSFET 100V, 20A, 52mΩ; Manufacturer Lifecycle Status: ACTIVE; Fall Time: 60ns; Number of Elements: 1; Power Dissipation: 110W; Gate to Source Voltage (Vgs): 16V; Element Configuration: Single; Input Capacitance: 1.285nF; Turn-On Delay Time: 6.8ns; Resistance: 54mΩ; Drain to Source Resistance: 41.5mΩ; Turn-Off Delay Time: 67ns; Rise Time: 28ns; Voltage Rating (DC): 100V; Drain to Source Voltage (Vdss): 100V; NexarPartId: 84329156; Mount: Surface Mount; Continuous Drain Current (ID): 20A; Current Rating: 20A; Drain to Source Breakdown Voltage: 100V; Weight: 260.37mg; Case/Package: TO-252-3; RoHS: Compliant; Rds On Max: 52mΩ; Max Power Dissipation: 110W; Min Operating Temperature: -55°C; Number of Pins: 3; Schedule B: 8541290080, 8541290080; Lead Free: Lead Free; Radiation Hardening: No; Lifecycle Status: Production; Max Operating Temperature: 175°C
R10 R12 R17-R19 R27-R31 R37 R39 R48 R49 = CRCW060310K0FKEI: Thick Film Resistors - SMD 10K OHM 1%; Manufacturer: Vishay; Value: 10k 1% 1/8W 0603; Manufacturer Part Number: CRCW060310K0FKEI; Distributor Link: https://www.vishay.com/docs/20035/dcrcwe3.pdf
R20 = CRCW08053K90FHTAP: Thick Film Resistors - SMD CRCW0805-P 3.9K 1% 50 RT1; Manufacturer: Vishay; Values: 3.9kohm 1% 0805 1/4W; Manufacturer Part Number: CRCW08053K90FHTAP; Distributor Link: https://www.mouser.tw/en/ProductDetail/Vishay/CRCW08053K90FHTAP?qs=Zz7%252BYVVL6bH%252BbAN5zIsieQ%3D%3D; Datasheet Link: https://www.vishay.com/docs/20035/dcrcwe3.pdf
R21 = NTCG163JH103HTDS: NTC Thermistors 0603 10Kohm 3% Thermistor AEC-Q200; Manufacturer Name: TDK; Values: 0603 10Kohm 3%; ComponentLink1Description: Distributor Link; ComponentLink1URL: https://www.mouser.tw/en/ProductDetail/TDK/NTCG163JH103HTDS?qs=5aG0NVq1C4zM%252BOwXBgXJzA%3D%3D; ComponentLink2Description: Datasheet Link; ComponentLink2URL: https://product.tdk.com/system/files/dam/doc/product/sensor/ntc/chip-ntc-thermistor/catalog/tpd_automotive_ntc-thermistor_ntcg_en.pdf?ref_disty=mouser
R22 = AC0603JR-071KL: Thick Film Resistors - SMD 1 kOhms 1/10 W 75 V 5% 0603 100 PPM / C - 55 C / + 155 C AEC-Q200; Manufacturer: YAGEO; Values: 1k 1/10W 5% 0603; Manufacturer Part Number: AC0603JR-071KL; Distributor Link: https://www.mouser.tw/en/ProductDetail/YAGEO/AC0603JR-071KL?qs=ygRr%2FtkhtetUuJMpTs3DCw%3D%3D; Datasheet Link: https://www.mouser.tw/datasheet/3/508/1/PYU_AC_51_ROHS_L.pdf
R23 = ERJ-U1TF47R0U: Thick Film Resistors - SMD 2512 1% 47ohm Anti-Sulfur AEC-Q200; Manufacturer: Panasonic; Values: 47ohm 1W 1% 2512; Manufacturer Part Number: ERJ-U1TF47R0U; Distributor Link: https://www.mouser.tw/en/ProductDetail/Panasonic/ERJ-U1TF47R0U?qs=pdFhdcvjjgisFXwKlPwjTg%3D%3D; Datasheet Link: https://industrial.panasonic.com/cdbs/www-data/pdf/RDO0000/RDO0000C334.pdf
R24 = RN73H1ETTP1003F50: Thin Film Resistors - SMD 100kOhm,0402,1%,50pp m,63mW,50V; Manufacturer: KOA Speer; Value: 100kohm 63mW 1% 50V 0402; Manufacturer Part Number: RN73H1ETTP1003F50; Distributor Link: https://www.mouser.tw/en/ProductDetail/KOA-Speer/RN73H1ETTP1003F50?qs=9tvNVxbbcErNimAbsV8w2A%3D%3D; Datasheet Link: https://www.mouser.com/catalog/specsheets/KOA_Speer_RN73H_8_21_24.pdf?_gl=1*o8km1j*_gcl_aw*R0NMLjE3ODUzMTQwMDguQ2p3S0NBand5YWJUQmhCRkVpd0FNM21OVUYxUXVUb0ZwX2dLajRxZHZDX2pVX0QwRUdOSWZ2RU5FN2JEQzdDSW5XclEtUVZ2eEpXemdSb0NLeGtRQXZEX0J3RQ..*_gcl_au*MTM0NzYwMzc0Mi4xNzgyNDQ3MDMwLjE1Njk2ODIzNTUuMTc4NTM4MDQ3My4xNzg1MzgxNDMxLjEzOTYzOTEyODMuMTc4NTMxNDU2Ny4xNzg1MzgxNDMx*_ga*MTg5NTU5OTIyLjE3ODI0NDcwMzM.*_ga_15W4STQT4T*czE3ODUzNzgxMTYkbzEwNCRnMSR0MTc4NTM4MTQzNyRqNTQkbDAkaDA.
R25 = AC0603JR-076K2L: Thick Film Resistors - SMD 6.2 kOhms 1/10 W 75 V 5% 0603 100 PPM / C - 55 C / + 155 C AEC-Q200; Manufacturer: YAGEO; Value: 6.2kohm 1/10W 5% 0603; Manufacturer Part Number: AC0603JR-076K2L; Distributor Link: https://www.mouser.tw/en/ProductDetail/YAGEO/AC0603JR-076K2L?qs=sGAEpiMZZMvdGkrng054twVr7TWeaA0stvTf8PmxIcM%3D; Datasheet Link: https://www.mouser.tw/datasheet/3/508/1/PYU_AC_51_ROHS_L.pdf
R26 = RC0603FR-1018KL: Thick Film Resistors - SMD General Purpose Chip Resistor 0603, 18kOhms, 1%, 1/10W; Manufacturer: YAGEO; Values: 18kohm 1% 1/10W 0603; Manufacturer Part Number: RC0603FR-1018KL; Distributor Link: https://www.mouser.tw/en/ProductDetail/YAGEO/RC0603FR-1018KL?qs=qpJ%252B%252B%252Bdg6p1T2VMMxU7GeA%3D%3D
R32-R35 = 35021K5FT: Thick Film Resistors - SMD 3502 1K5 1%; Manufacturer: TE Connectivity; Values: 1.5k 2W 1% 2010; Manufacturer Part Number: 35021K5FT; Distributor Link: https://www.mouser.tw/en/ProductDetail/TE-Connectivity-Holsworthy/35021K5FT?qs=gZXFycFWdAP5xURCJH31VQ%3D%3D; Datasheet Link: https://www.te.com/commerce/DocumentDelivery/DDEController?Action=showdoc&DocId=Data%20Sheet%7F1773204-4%7FA%7Fpdf%7FEnglish%7FENG_DS_1773204-4_A.pdf%7F2176397-76
RDRV1-RDRV14 = CRCW060339R0FKEAHP: Thick Film Resistors - SMD 0.75W 39ohms 1% High Power AEC-Q200; Manufacturer: Vishay; Values: 39ohm 3/4W 1% 0603; Manufacturer Part Number: CRCW060339R0FKEAHP; Distributor Link: https://www.mouser.tw/en/ProductDetail/Vishay/CRCW060339R0FKEAHP?qs=YmE2lSBYOPkz7Ks0zEhjEg%3D%3D; Datasheet Link: https://www.vishay.com/docs/20115/crcwhp.pdf
RISENSE1 RISENSE2 = CRM2010-FX-1000ELF: Current Sense Resistors - SMD CHIP RESISTOR Low Value 100ohm 1W 1% 2010 Thick Film Resistor; Manufacturer: Bourns; Manufacturer Part Number: CRM2010-FX-1000ELF; Distributor Link: https://www.mouser.tw/en/ProductDetail/Bourns/CRM2010-FX-1000ELF?qs=fgHA1UgJI8Bqg2%2Fam14ESQ%3D%3D; Datasheet Link: https://www.mouser.tw/datasheet/3/40/1/crm0805_1206_2010.pdf; Values: 100ohm 1W 1% 2010
RLPF1-RLPF15 = CRCW0603100RJNEBC: Thick Film Resistors - SMD 1/10Watt 100ohms 5% 0603 Commercial Use; Manufacturer: Vishay; Values: 100ohm 1/10W 5% 0603; Manufacturer Part Number: CRCW0603100RJNEBC; Distributor Link: https://www.mouser.tw/en/ProductDetail/YAGEO/RT0603WRE07100RL?qs=sGAEpiMZZMtlubZbdhIBIKm0gsRX2fVkkBVJnMJ1ydc%3D; Datasheet Link: https://www.vishay.com/docs/20035/dcrcwe3.pdf
RSENSE = WSLP5931L1000FEA: Current Sense Resistors - SMD 0.0001 ohm 1%; Manufacturer: Vishay/Dale; Values: 100uohm 15W 1% 5931; Manufacturer Part Number: WSLP5931L1000FEA; Distributor Link: https://www.mouser.tw/en/ProductDetail/Vishay-Dale/WSLP5931L1000FEA?qs=AQlKX63v8Rs%252BJpQIynINvA%3D%3D; Datasheet Link: https://www.vishay.com/doc?30176
TPC0-TPC14 TPVBAT TPVREG = CMP-1672-00006-4: Test Point, Yellow, Through Hole, RoHS, Bulk; Manufacturer: Keystone; PackageDescription: 1-Pin Through Hole Device, Dia 3.17 mm; REACH SVHC: No SVHC; ComponentLink2Description: Datasheet; ComponentLink2URL: http://www.keyelco.com/product-pdf.cfm?p=1323; Package Quantity: 100; Colour: Yellow; Height: 8.12 mm; RoHSCompliant: true; Contact Material: Bronze; Mount: Through Hole; Contact Plating: Silver; ComponentLink1URL: http://www.keyelco.com/; Packaging: Bulk; Mounting Technology: Through Hole; PackageReference: 5014; ComponentLink1Description: Manufacturer URL; DatasheetVersion: Rev. F, 12/2013
U5 = L9963E-TR: Battery Management Automotive chip for battery management applications with daisy chain up to 31 de; Manufacturer Name: STMicroelectronics; Distributor Name: Mouser; ComponentLink1Description: Datasheet Link; ComponentLink1URL: https://www.st.com/resource/en/datasheet/l9963e.pdf